# Altium schematic sheet XP4.SchDoc: XP4 Connections
size A; Organization: UCLA High Energy Physics; Address1: L3, 12a Rodborough Rd; Address2: Frenchs Forest; Address3: NSW; Address4: Australia 2086; DocumentNumber: 6; Revision: 2.0; SheetNumber: 6; SheetTotal: 23; CurrentDate: 9/6/2018; ModifiedDate: 9/6/2018; ProjectName: Project
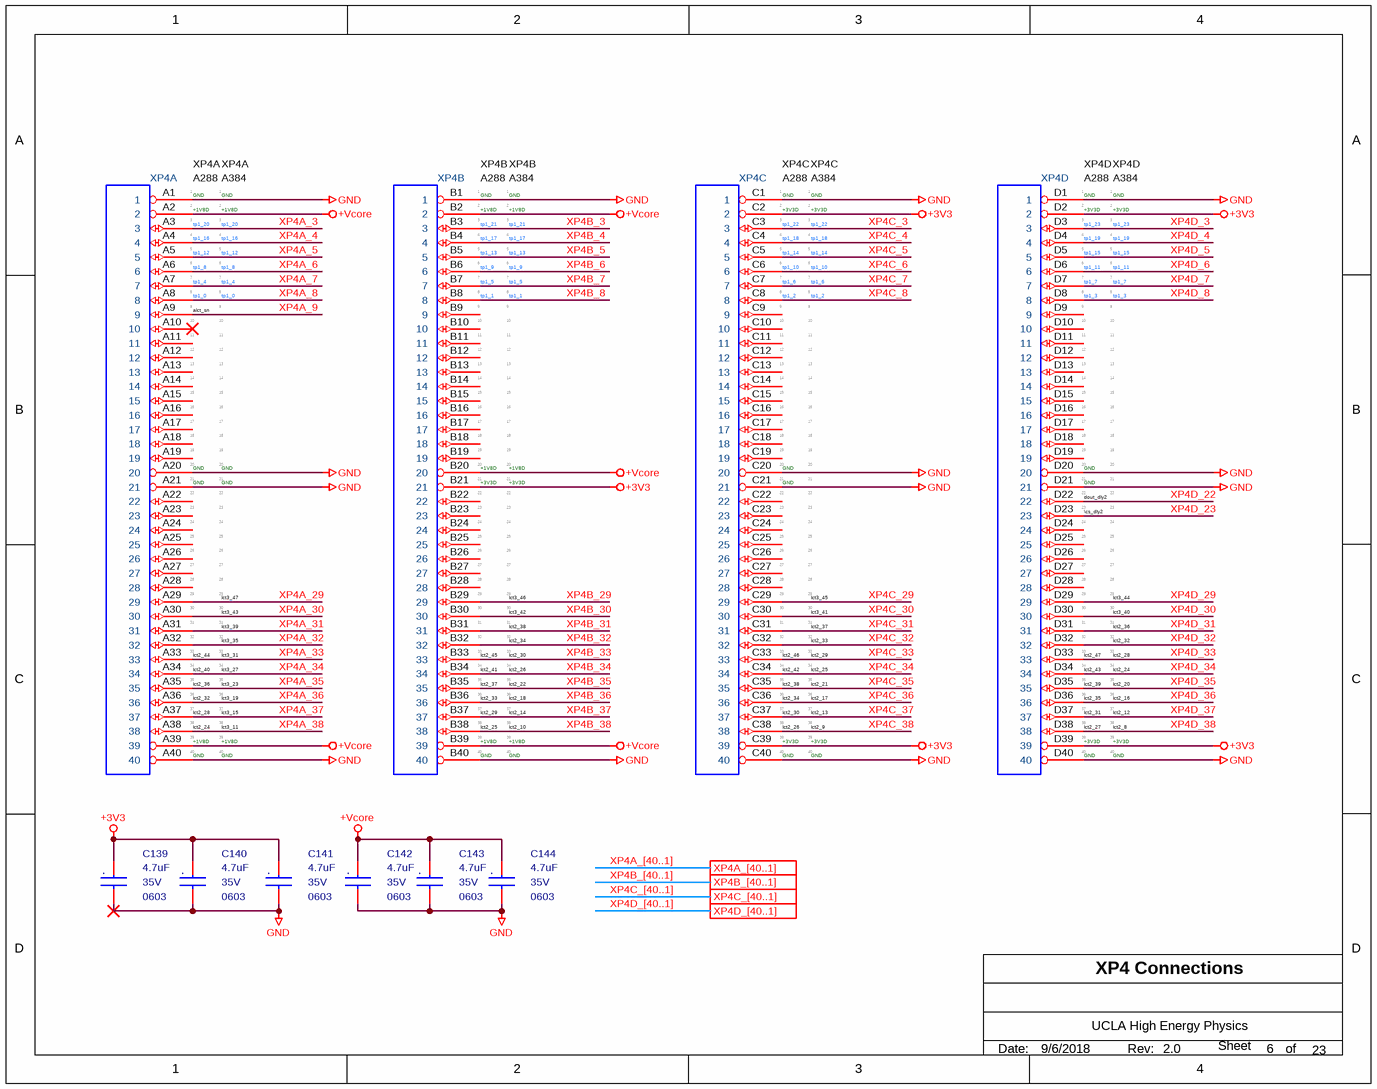
[diagram p0: XP4.SchDoc]

## Parts
(Parts that share a designator on the sheet are numbered #1, #2 ... from top to bottom, then left to right.)
C139  4.7uF  Voltage - Rated: 35V  package: 0603  [MC_S6/SM/C_0603_IPC]
C140  4.7uF  Voltage - Rated: 35V  package: 0603  [MC_S6/SM/C_0603_IPC]
C141  4.7uF  Voltage - Rated: 35V  package: 0603  [MC_S6/SM/C_0603_IPC]
C142  4.7uF  Voltage - Rated: 35V  package: 0603  [MC_S6/SM/C_0603_IPC]
C143  4.7uF  Voltage - Rated: 35V  package: 0603  [MC_S6/SM/C_0603_IPC]
C144  4.7uF  Voltage - Rated: 35V  package: 0603  [MC_S6/SM/C_0603_IPC]
XP4  Samtec_XP4  [MC_S6/TH/SAMTEC_MOLC_40x4]  (value not drawn)  (parts A,B,C,D of 4)
XP?#1  A288_XP4  (value not drawn)  (part A of 4)  (graphical)
XP?#2  A384_XP4  (value not drawn)  (part A of 4)  (graphical)
XP?#3  A288_XP4  (value not drawn)  (part B of 4)  (graphical)
XP?#4  A384_XP4  (value not drawn)  (part B of 4)  (graphical)
XP?#5  A288_XP4  (value not drawn)  (part C of 4)  (graphical)
XP?#6  A384_XP4  (value not drawn)  (part C of 4)  (graphical)
XP?#7  A288_XP4  (value not drawn)  (part D of 4)  (graphical)
XP?#8  A384_XP4  (value not drawn)  (part D of 4)  (graphical)

## Ports
XP4A_[40..1], XP4B_[40..1], XP4C_[40..1], XP4D_[40..1]

## Nets
+3V3: C139.1 C140.1 C141.1 XP4.B21(21) XP4.C2(2) XP4.C39(39) XP4.D2(2) XP4.D39(39)
+Vcore: C142.1 C143.1 C144.1 XP4.A2(2) XP4.A39(39) XP4.B2(2) XP4.B20(20) XP4.B39(39)
GND: C139.2 C140.2 C141.2 C142.2 C143.2 C144.2 XP4.A1(1) XP4.A20(20) XP4.A21(21) XP4.A40(40) XP4.B1(1) XP4.B40(40) XP4.C1(1) XP4.C20(20) XP4.C21(21) XP4.C40(40) XP4.D1(1) XP4.D20(20) XP4.D21(21) XP4.D40(40)
XP4A_3: XP4.A3(3)
XP4A_4: XP4.A4(4)
XP4A_5: XP4.A5(5)
XP4A_6: XP4.A6(6)
XP4A_7: XP4.A7(7)
XP4A_8: XP4.A8(8)
XP4A_9: XP4.A9(9)
XP4A_29: XP4.A29(29)
XP4A_30: XP4.A30(30)
XP4A_31: XP4.A31(31)
XP4A_32: XP4.A32(32)
XP4A_33: XP4.A33(33)
XP4A_34: XP4.A34(34)
XP4A_35: XP4.A35(35)
XP4A_36: XP4.A36(36)
XP4A_37: XP4.A37(37)
XP4A_38: XP4.A38(38)
XP4B_3: XP4.B3(3)
XP4B_4: XP4.B4(4)
XP4B_5: XP4.B5(5)
XP4B_6: XP4.B6(6)
XP4B_7: XP4.B7(7)
XP4B_8: XP4.B8(8)
XP4B_29: XP4.B29(29)
XP4B_30: XP4.B30(30)
XP4B_31: XP4.B31(31)
XP4B_32: XP4.B32(32)
XP4B_33: XP4.B33(33)
XP4B_34: XP4.B34(34)
XP4B_35: XP4.B35(35)
XP4B_36: XP4.B36(36)
XP4B_37: XP4.B37(37)
XP4B_38: XP4.B38(38)
XP4C_3: XP4.C3(3)
XP4C_4: XP4.C4(4)
XP4C_5: XP4.C5(5)
XP4C_6: XP4.C6(6)
XP4C_7: XP4.C7(7)
XP4C_8: XP4.C8(8)
XP4C_29: XP4.C29(29)
XP4C_30: XP4.C30(30)
XP4C_31: XP4.C31(31)
XP4C_32: XP4.C32(32)
XP4C_33: XP4.C33(33)
XP4C_34: XP4.C34(34)
XP4C_35: XP4.C35(35)
XP4C_36: XP4.C36(36)
XP4C_37: XP4.C37(37)
XP4C_38: XP4.C38(38)
XP4D_3: XP4.D3(3)
XP4D_4: XP4.D4(4)
XP4D_5: XP4.D5(5)
XP4D_6: XP4.D6(6)
XP4D_7: XP4.D7(7)
XP4D_8: XP4.D8(8)
XP4D_22: XP4.D22(22)
XP4D_23: XP4.D23(23)
XP4D_29: XP4.D29(29)
XP4D_30: XP4.D30(30)
XP4D_31: XP4.D31(31)
XP4D_32: XP4.D32(32)
XP4D_33: XP4.D33(33)
XP4D_34: XP4.D34(34)
XP4D_35: XP4.D35(35)
XP4D_36: XP4.D36(36)
XP4D_37: XP4.D37(37)
XP4D_38: XP4.D38(38)

Not connected (* = marked no-connect by the designer): XP4 A10(10)* A11(11) A12(12) A13(13) A14(14) A15(15) A16(16) A17(17) A18(18) A19(19) A22(22) A23(23) A24(24) A25(25) A26(26) A27(27) A28(28) B9(9) B10(10) B11(11) B12(12) B13(13) B14(14) B15(15) B16(16) B17(17) B18(18) B19(19) B22(22) B23(23) B24(24) B25(25) B26(26) B27(27) B28(28) C9(9) C10(10) C11(11) C12(12) C13(13) C14(14) C15(15) C16(16) C17(17) C18(18) C19(19) C22(22) C23(23) C24(24) C25(25) C26(26) C27(27) C28(28) D9(9) D10(10) D11(11) D12(12) D13(13) D14(14) D15(15) D16(16) D17(17) D18(18) D19(19) D24(24) D25(25) D26(26) D27(27) D28(28)

## Buses and harness runs
bus XP4A_[40..1] = port XP4A_[40..1]
bus XP4B_[40..1] = port XP4B_[40..1]
bus XP4C_[40..1] = port XP4C_[40..1]
bus XP4D_[40..1] = port XP4D_[40..1]

## Notes on the sheet
- Date:
- Rev:
- of
- Sheet
- (in symbol A288_XP4, part A) XP4A; A288; 1; GND; 2; +1V8D; 3; tp1_20; 4; tp1_16; 5; tp1_12; 6; tp1_8; 7; tp1_4; 8; tp1_0; 9; alct_sn; 10; 11; 12; 13; 14; 15; 16; 17; 18; 19; 20; 21; 22; 23; 24; 25; 26; 27; 28; 29; 30; 31; 32; 33; lct2_44; 34; lct2_40; 35; lct2_36; 36; lct2_32; 37; lct2_28; 38; lct2_24; 39; 40
- (in symbol A288_XP4, part B) XP4B; A288; 1; GND; 2; +1V8D; 3; tp1_21; 4; tp1_17; 5; tp1_13; 6; tp1_9; 7; tp1_5; 8; tp1_1; 9; 10; 11; 12; 13; 14; 15; 16; 17; 18; 19; 20; 21; +3V3D; 22; 23; 24; 25; 26; 27; 28; 29; 30; 31; 32; 33; lct2_45; 34; lct2_41; 35; lct2_37; 36; lct2_33; 37; lct2_29; 38; lct2_25; 39; 40
- (in symbol A288_XP4, part C) XP4C; A288; 1; GND; 2; +3V3D; 3; tp1_22; 4; tp1_18; 5; tp1_14; 6; tp1_10; 7; tp1_6; 8; tp1_2; 9; 10; 11; 12; 13; 14; 15; 16; 17; 18; 19; 20; 21; 22; 23; 24; 25; 26; 27; 28; 29; 30; 31; 32; 33; lct2_46; 34; lct2_42; 35; lct2_38; 36; lct2_34; 37; lct2_30; 38; lct2_26; 39; 40
- (in symbol A288_XP4, part D) XP4D; A288; 1; GND; 2; +3V3D; 3; tp1_23; 4; tp1_19; 5; tp1_15; 6; tp1_11; 7; tp1_7; 8; tp1_3; 9; 10; 11; 12; 13; 14; 15; 16; 17; 18; 19; 20; 21; 22; dout_dly2; 23; \cs_dly2; 24; 25; 26; 27; 28; 29; 30; 31; 32; 33; lct2_47; 34; lct2_43; 35; lct2_39; 36; lct2_35; 37; lct2_31; 38; lct2_27; 39; 40
- (in symbol A384_XP4, part A) XP4A; A384; 1; GND; 2; +1V8D; 3; tp1_20; 4; tp1_16; 5; tp1_12; 6; tp1_8; 7; tp1_4; 8; tp1_0; 9; 10; 11; 12; 13; 14; 15; 16; 17; 18; 19; 20; 21; 22; 23; 24; 25; 26; 27; 28; 29; lct3_47; 30; lct3_43; 31; lct3_39; 32; lct3_35; 33; lct3_31; 34; lct3_27; 35; lct3_23; 36; lct3_19; 37; lct3_15; 38; lct3_11; 39; 40
- (in symbol A384_XP4, part B) XP4B; A384; 1; GND; 2; +1V8D; 3; tp1_21; 4; tp1_17; 5; tp1_13; 6; tp1_9; 7; tp1_5; 8; tp1_1; 9; 10; 11; 12; 13; 14; 15; 16; 17; 18; 19; 20; 21; +3V3D; 22; 23; 24; 25; 26; 27; 28; 29; lct3_46; 30; lct3_42; 31; lct2_38; 32; lct2_34; 33; lct2_30; 34; lct2_26; 35; lct2_22; 36; lct2_18; 37; lct2_14; 38; lct2_10; 39; 40
- (in symbol A384_XP4, part C) XP4C; A384; 1; GND; 2; +3V3D; 3; tp1_22; 4; tp1_18; 5; tp1_14; 6; tp1_10; 7; tp1_6; 8; tp1_2; 9; 10; 11; 12; 13; 14; 15; 16; 17; 18; 19; 20; 21; 22; 23; 24; 25; 26; 27; 28; 29; lct3_45; 30; lct3_41; 31; lct2_37; 32; lct2_33; 33; lct2_29; 34; lct2_25; 35; lct2_21; 36; lct2_17; 37; lct2_13; 38; lct2_9; 39; 40
- (in symbol A384_XP4, part D) XP4D; A384; 1; GND; 2; +3V3D; 3; tp1_23; 4; tp1_19; 5; tp1_15; 6; tp1_11; 7; tp1_7; 8; tp1_3; 9; 10; 11; 12; 13; 14; 15; 16; 17; 18; 19; 20; 21; 22; 23; 24; 25; 26; 27; 28; 29; lct3_44; 30; lct3_40; 31; lct2_36; 32; lct2_32; 33; lct2_28; 34; lct2_24; 35; lct2_20; 36; lct2_16; 37; lct2_12; 38; lct2_8; 39; 40
- (in symbol GRM188R6YA475KE15D) .
- (in symbol Samtec_XP4, part A) XP4A
- (in symbol Samtec_XP4, part B) XP4B
- (in symbol Samtec_XP4, part C) XP4C
- (in symbol Samtec_XP4, part D) XP4D

## Library data of the parts
C139-C144 = GRM188R6YA475KE15D: CAP CER 4.7UF 35V X5R 0603; Manufacturer: Murata; Product Training Modules: High-Cap Multilayer Ceramic Capacitors; Featured Product: GA3 Safety Recognized Capacitors; EDA / CAD Models: Download from Accelerated Designs; Capacitance: 4.7µF; Tolerance: ±10%; Online Catalog: GRM Series; Other Names: 490-7205-2; Supplier 1: Digikey; Manufacturer Part Number: GRM188R6YA475KE15D; Stock 1: 180441; Pricing 1: 1=0.32, 10=0.264, 50=0.1486, 100=0.132, 250=0.099, 500=0.0875, 1000=0.0776 (USD); Standard Package: 4,000; Category: Capacitors; Family: Ceramic Capacitors; Series: GRM; Packaging: Tape & Reel (TR); Temperature Coefficient: X5R; Mounting Type: Surface Mount, MLCC; Operating Temperature: -55°C ~ 85°C; Applications: General Purpose; Package / Case: 0603 (1608 Metric); Size / Dimension: 0.063" L x 0.031" W (1.60mm x 0.80mm); Thickness (Max): 0.031" (0.80mm); ComponentLink1URL: https://datasheet.ciiva.com/46444/1769893-46444984.pdf; ComponentLink1Description: https://datasheet.ciiva.com/46444/1769893-46444984.pdf; ComponentLink2URL: https://datasheet.ciiva.com/46444/1769893-46444985.pdf; ComponentLink2Description: https://datasheet.ciiva.com/46444/1769893-46444985.pdf; ComponentLink3URL: https://datasheet.ciiva.com/14906/partnumbering-e-01-14906426.pdf; ComponentLink3Description: https://datasheet.ciiva.com/14906/partnumbering-e-01-14906426.pdf; ComponentLink4URL: https://datasheet.ciiva.com/14906/partnumbering-e-01-14906427.pdf; ComponentLink4Description: https://datasheet.ciiva.com/14906/partnumbering-e-01-14906427.pdf; ComponentLink5URL: https://datasheet.ciiva.com/14906/partnumbering-e-01-14906428.pdf; ComponentLink5Description: https://datasheet.ciiva.com/14906/partnumbering-e-01-14906428.pdf; Supplier 2: Digikey; Stock 2: 180441; Pricing 2: 1=0.32, 10=0.264, 50=0.1486, 100=0.132, 250=0.099, 500=0.0875, 1000=0.0776 (USD); Supplier Part Number 1: 490-7205-1-ND; Supplier Part Number 2: 490-7205-6-ND
XP4 = Samtec_XP4: Manufacturer Part Number: MOLC-140-01-L-Q-LC; mfgr_id: MOLC-140-01-S-Q-LC; mfgr: Samtec; mfgr_foot: 40x4; COMPROT: 180; COMPGROUP: 0; COMPSIDE: TOP; Contact Termination Type: Through Hole; Gender: Header; No. of Contacts: 160; No. of Rows: 4; Pitch Spacing: 1.27; Product Range: MOLC Series; SVHC: No SVHC (12-Jan-2017; Package: XP4; ComponentLink1Description: http://www.farnell.com/cad/2261282.pdf; ComponentLink1URL: http://www.farnell.com/cad/2261282.pdf; ComponentLink2Description: http://www.farnell.com/datasheets/2261038.pdf; ComponentLink2URL: http://www.farnell.com/datasheets/2261038.pdf; Contact Material: Phosphor Bronze; Contact Plating: Gold Plated Contacts; Manufacturer: SAMTEC; Pricing 1: 1=18.16, 3=17.11, 5=16.18, 10=15.35, 15=14.96, 25=14.34 (GBP); RoHS: YES; Stock 1: 0; Supplier 1: Farnell; Supplier Part Number 1: 2732055
XP?#1 XP?#3 XP?#5 XP?#7 = A288_XP4: mfgr_id: MOLC-140-01-S-Q-LC; mfgr: Samtec; mfgr_foot: 40x4; COMPROT: 180; COMPGROUP: 0; COMPSIDE: TOP; Package: XP4
XP?#2 XP?#4 XP?#6 XP?#8 = A384_XP4: mfgr_id: MOLC-140-01-S-Q-LC; mfgr: Samtec; mfgr_foot: 40x4; COMPROT: 180; COMPGROUP: 0; COMPSIDE: TOP; Package: XP4